# Altium schematic sheet ADC.SchDoc (part 1 of 3)
size Letter; DrawnBy: Titan Yuan; SheetNumber: 6; SheetTotal: 9
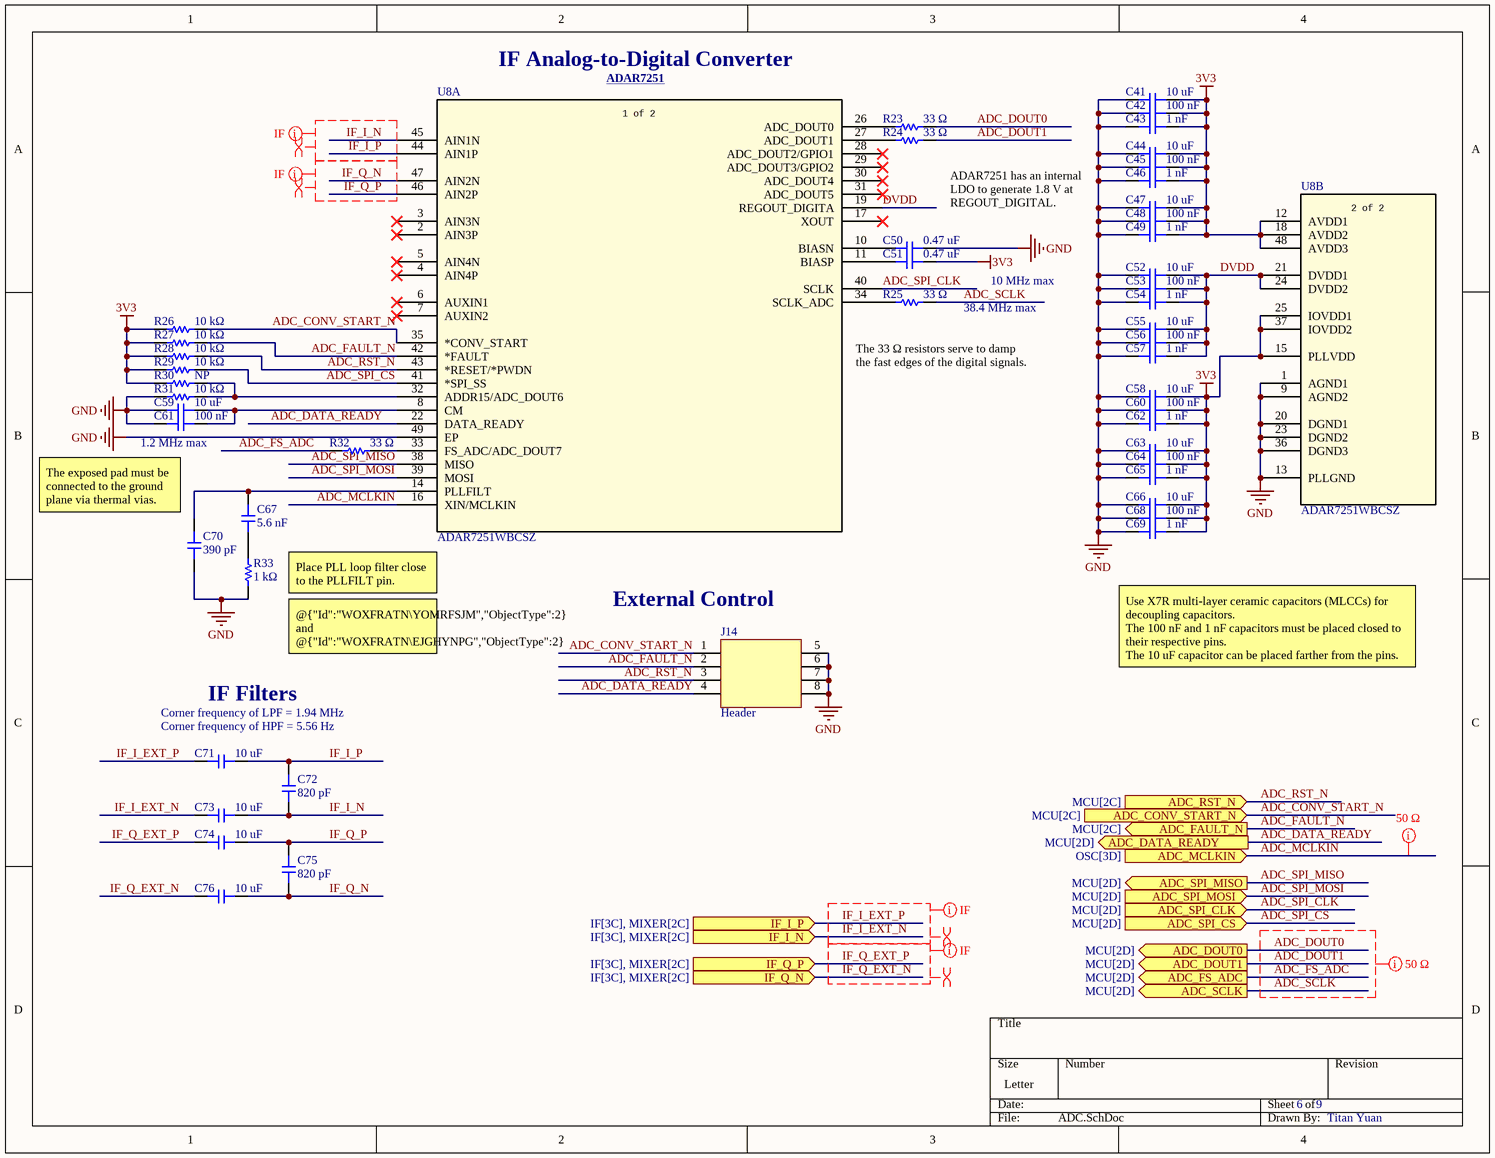
[diagram p0: ADC.SchDoc]

## Parts
C41  10 uF  [CAP_0805]
C42  100 nF  [CAP_0402]
C43  1 nF  [CAP_0402]
C44  10 uF  [CAP_0805]
C45  100 nF  [CAP_0402]
C46  1 nF  [CAP_0402]
C47  10 uF  [CAP_0805]
C48  100 nF  [CAP_0402]
C49  1 nF  [CAP_0402]
C50  0.47 uF  [CAP_0402]
C51  0.47 uF  [CAP_0402]
C52  10 uF  [CAP_0805]
C53  100 nF  [CAP_0402]
C54  1 nF  [CAP_0402]
C55  10 uF  [CAP_0805]
C56  100 nF  [CAP_0402]
C57  1 nF  [CAP_0402]
C58  10 uF  [CAP_0805]
C59  10 uF  [CAP_0805]
C60  100 nF  [CAP_0402]
C61  100 nF  [CAP_0402]
C62  1 nF  [CAP_0402]
C63  10 uF  [CAP_0805]
C64  100 nF  [CAP_0402]
C65  1 nF  [CAP_0402]
C66  10 uF  [CAP_0805]
C67  5.6 nF  [CAP_0402]
C68  100 nF  [CAP_0402]
C69  1 nF  [CAP_0402]
C70  390 pF  [CAP_0402]
C71  10 uF  [CAP_0805]
C72  820 pF  [CAP_0603]
C73  10 uF  [CAP_0805]
C74  10 uF  [CAP_0805]
C75  820 pF  [CAP_0603]
C76  10 uF  [CAP_0805]
J14  Header  [CONN_2x4_2.54mm_PinHeader_Vertical]
R23  33 Ω  [RES_0402]
R24  33 Ω  [RES_0402]
R25  33 Ω  [RES_0402]
R26  10 kΩ  [RES_0402]
R27  10 kΩ  [RES_0402]
R28  10 kΩ  [RES_0402]
R29  10 kΩ  [RES_0402]
R30  NP  [RES_0402]
R31  10 kΩ  [RES_0402]
R32  33 Ω  [RES_0402]
R33  1 kΩ  [RES_0402]
U8  ADAR7251WBCSZ  [CS_48_1_ADI]  (parts A,B of 2)

## Ports
ADC_CONV_START_N (in, see MCU[2C]), ADC_DATA_READY (out, see MCU[2D]), ADC_DOUT0 (out, see MCU[2D]), ADC_DOUT1 (out, see MCU[2D]), ADC_FAULT_N (out, see MCU[2C]), ADC_FS_ADC (out, see MCU[2D]), ADC_MCLKIN (in, see OSC[3D]), ADC_RST_N (in, see MCU[2C]), ADC_SCLK (out, see MCU[2D]), ADC_SPI_CLK (in, see MCU[2D]), ADC_SPI_CS (in, see MCU[2D]), ADC_SPI_MISO (out, see MCU[2D]), ADC_SPI_MOSI (in, see MCU[2D]), IF_I_N (in, see IF[3C], MIXER[2C]), IF_I_P (in, see IF[3C], MIXER[2C]), IF_Q_N (in, see IF[3C], MIXER[2C]), IF_Q_P (in, see IF[3C], MIXER[2C])

## Nets
3V3: C41.2 C42.2 C43.2 C44.2 C45.2 C46.2 C47.2 C48.2 C49.2 C51.1 C58.2 C60.2 C62.2 C63.2 C64.2 C65.2 C66.2 C68.2 C69.2 R26.2 R27.2 R28.2 R29.2 R30.2 U8.12(AVDD1) U8.15(PLLVDD) U8.18(AVDD2) U8.25(IOVDD1) U8.37(IOVDD2) U8.48(AVDD3)
GND: C41.1 C42.1 C43.1 C44.1 C45.1 C46.1 C47.1 C48.1 C49.1 C50.1 C52.1 C53.1 C54.1 C55.1 C56.1 C57.1 C58.1 C59.1 C60.1 C61.1 C62.1 C63.1 C64.1 C65.1 C66.1 C68.1 C69.1 C70.1 J14.5 J14.6 J14.7 J14.8 R31.2 R33.1 U8.1(AGND1) U8.9(AGND2) U8.13(PLLGND) U8.20(DGND1) U8.23(DGND2) U8.36(DGND3) U8.49(EP)
ADC_CONV_START_N: J14.1 R26.1 U8.35(*CONV_START) ; port ADC_CONV_START_N
ADC_DATA_READY: J14.4 U8.22(DATA_READY) ; port ADC_DATA_READY
ADC_DOUT0: R23.2 ; port ADC_DOUT0
ADC_DOUT1: R24.2 ; port ADC_DOUT1
ADC_FAULT_N: J14.2 R27.1 U8.42(*FAULT) ; port ADC_FAULT_N
ADC_FS_ADC: R32.1 ; port ADC_FS_ADC
ADC_MCLKIN: U8.16(XIN/MCLKIN) ; port ADC_MCLKIN
ADC_RST_N: J14.3 R28.1 U8.43(*RESET/*PWDN) ; port ADC_RST_N
ADC_SCLK: R25.2 ; port ADC_SCLK
ADC_SPI_CLK: U8.40(SCLK) ; port ADC_SPI_CLK
ADC_SPI_CS: R29.1 U8.41(*SPI_SS) ; port ADC_SPI_CS
ADC_SPI_MISO: U8.38(MISO) ; port ADC_SPI_MISO
ADC_SPI_MOSI: U8.39(MOSI) ; port ADC_SPI_MOSI
DVDD: C52.2 C53.2 C54.2 C55.2 C56.2 C57.2 U8.19(REGOUT_DIGITA) U8.21(DVDD1) U8.24(DVDD2)
IF_I_EXT_N: C73.1 ; port IF_I_N
IF_I_EXT_P: C71.1 ; port IF_I_P
IF_I_N: C72.1 C73.2 U8.45(AIN1N)
IF_I_P: C71.2 C72.2 U8.44(AIN1P)
IF_Q_EXT_N: C76.1 ; port IF_Q_N
IF_Q_EXT_P: C74.1 ; port IF_Q_P
IF_Q_N: C75.1 C76.2 U8.47(AIN2N)
IF_Q_P: C74.2 C75.2 U8.46(AIN2P)
NetC50_2: C50.2 U8.10(BIASN)
NetC51_2: C51.2 U8.11(BIASP)
NetC59_2: C59.2 C61.2 U8.8(CM)
NetC67_1: C67.1 R33.2
NetC67_2: C67.2 C70.2 U8.14(PLLFILT)
NetR23_1: R23.1 U8.26(ADC_DOUT0)
NetR24_1: R24.1 U8.27(ADC_DOUT1)
NetR25_1: R25.1 U8.34(SCLK_ADC)
NetR30_1: R30.1 R31.1 U8.32(ADDR15/ADC_DOUT6)
NetR32_2: R32.2 U8.33(FS_ADC/ADC_DOUT7)

Not connected (* = marked no-connect by the designer): U8 2(AIN3P)* 3(AIN3N)* 4(AIN4P)* 5(AIN4N)* 6(AUXIN1)* 7(AUXIN2)* 17(XOUT)* 28(ADC_DOUT2/GPIO1)* 29(ADC_DOUT3/GPIO2)* 30(ADC_DOUT4)* 31(ADC_DOUT5)*

## Layout directives
net class 50 Ω: ADC_DOUT0, ADC_DOUT1, ADC_FS_ADC, ADC_MCLKIN, ADC_SCLK
differential pair: IF_I_EXT_N, IF_I_EXT_P, IF_I_N, IF_I_P, IF_Q_EXT_N, IF_Q_EXT_P, IF_Q_N, IF_Q_P
mark named IF: IF_I_EXT_N, IF_I_EXT_P, IF_I_N, IF_I_P, IF_Q_EXT_N, IF_Q_EXT_P, IF_Q_N, IF_Q_P

## Notes on the sheet
- IF Analog-to-Digital Converter
- (near U8) ADAR7251 <https://www.analog.com/en/products/adar7251.html>
- ADAR7251 has an internal LDO to generate 1.8 V at REGOUT_DIGITAL.
- 10 MHz max
- (near U8) The 33 Ω resistors serve to damp the fast edges of the digital signals.
- 38.4 MHz max
- The exposed pad must be connected to the ground plane via thermal vias.
- (near C61) 1.2 MHz max
- Place PLL loop filter close to the PLLFILT pin.
- (near J14) External Control
- IF Filters
- (near R33) @{"Id":"WOXFRATN\YOMRFSJM","ObjectType":2} and @{"Id":"WOXFRATN\EJGHYNPG","ObjectType":2} must be NPO type for best temperature performance.
- Use X7R multi-layer ceramic capacitors (MLCCs) for decoupling capacitors.
  The 100 nF and 1 nF capacitors must be placed closed to their respective pins.
  The 10 uF capacitor can be placed farther from the pins.
- Corner frequency of LPF = 1.94 MHz
- Corner frequency of HPF = 5.56 Hz
- (in symbol ADAR7251WBCSZ, part A) 1 of 2
- (in symbol ADAR7251WBCSZ, part B) 2 of 2